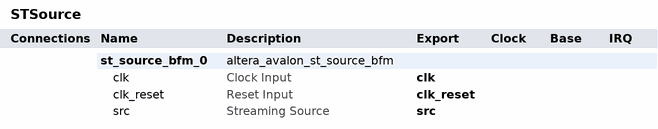
[diagram p0: system contents]
# Platform Designer (Qsys) system STSource, MAX 10 10M08SAE144C8GES
# Parameters at their usual value, and those the tool derives, are not listed.
package require -exact qsys 20.1
create_system STSource
set_project_property DEVICE_FAMILY {MAX 10}
set_project_property DEVICE 10M08SAE144C8GES

add_instance st_source_bfm_0 altera_avalon_st_source_bfm 20.1
set_instance_property st_source_bfm_0 AUTO_EXPORT true
set_instance_parameter_value st_source_bfm_0 ST_CHANNEL_W 1
set_instance_parameter_value st_source_bfm_0 ST_ERROR_W 1
set_instance_parameter_value st_source_bfm_0 ST_MAX_CHANNELS 1
set_instance_parameter_value st_source_bfm_0 ST_NUMSYMBOLS 4
set_instance_parameter_value st_source_bfm_0 ST_SYMBOL_W 8
set_instance_parameter_value st_source_bfm_0 USE_CHANNEL 0
set_instance_parameter_value st_source_bfm_0 USE_EMPTY 0
set_instance_parameter_value st_source_bfm_0 USE_ERROR 0
set_instance_parameter_value st_source_bfm_0 USE_PACKET 0
set_instance_parameter_value st_source_bfm_0 USE_READY 1
set_instance_parameter_value st_source_bfm_0 USE_VALID 1

# exported interfaces
add_interface clk clock sink
set_interface_property clk EXPORT_OF st_source_bfm_0.clk
add_interface clk_reset reset sink
set_interface_property clk_reset EXPORT_OF st_source_bfm_0.clk_reset
add_interface src avalon_streaming source
set_interface_property src EXPORT_OF st_source_bfm_0.src

set_interconnect_requirement {$system} qsys_mm.clockCrossingAdapter HANDSHAKE
set_interconnect_requirement {$system} qsys_mm.enableEccProtection FALSE
set_interconnect_requirement {$system} qsys_mm.insertDefaultSlave FALSE
set_interconnect_requirement {$system} qsys_mm.maxAdditionalLatency 1

save_system STSource.qsys
